# Altium project controller_V1.2.PrjPcb
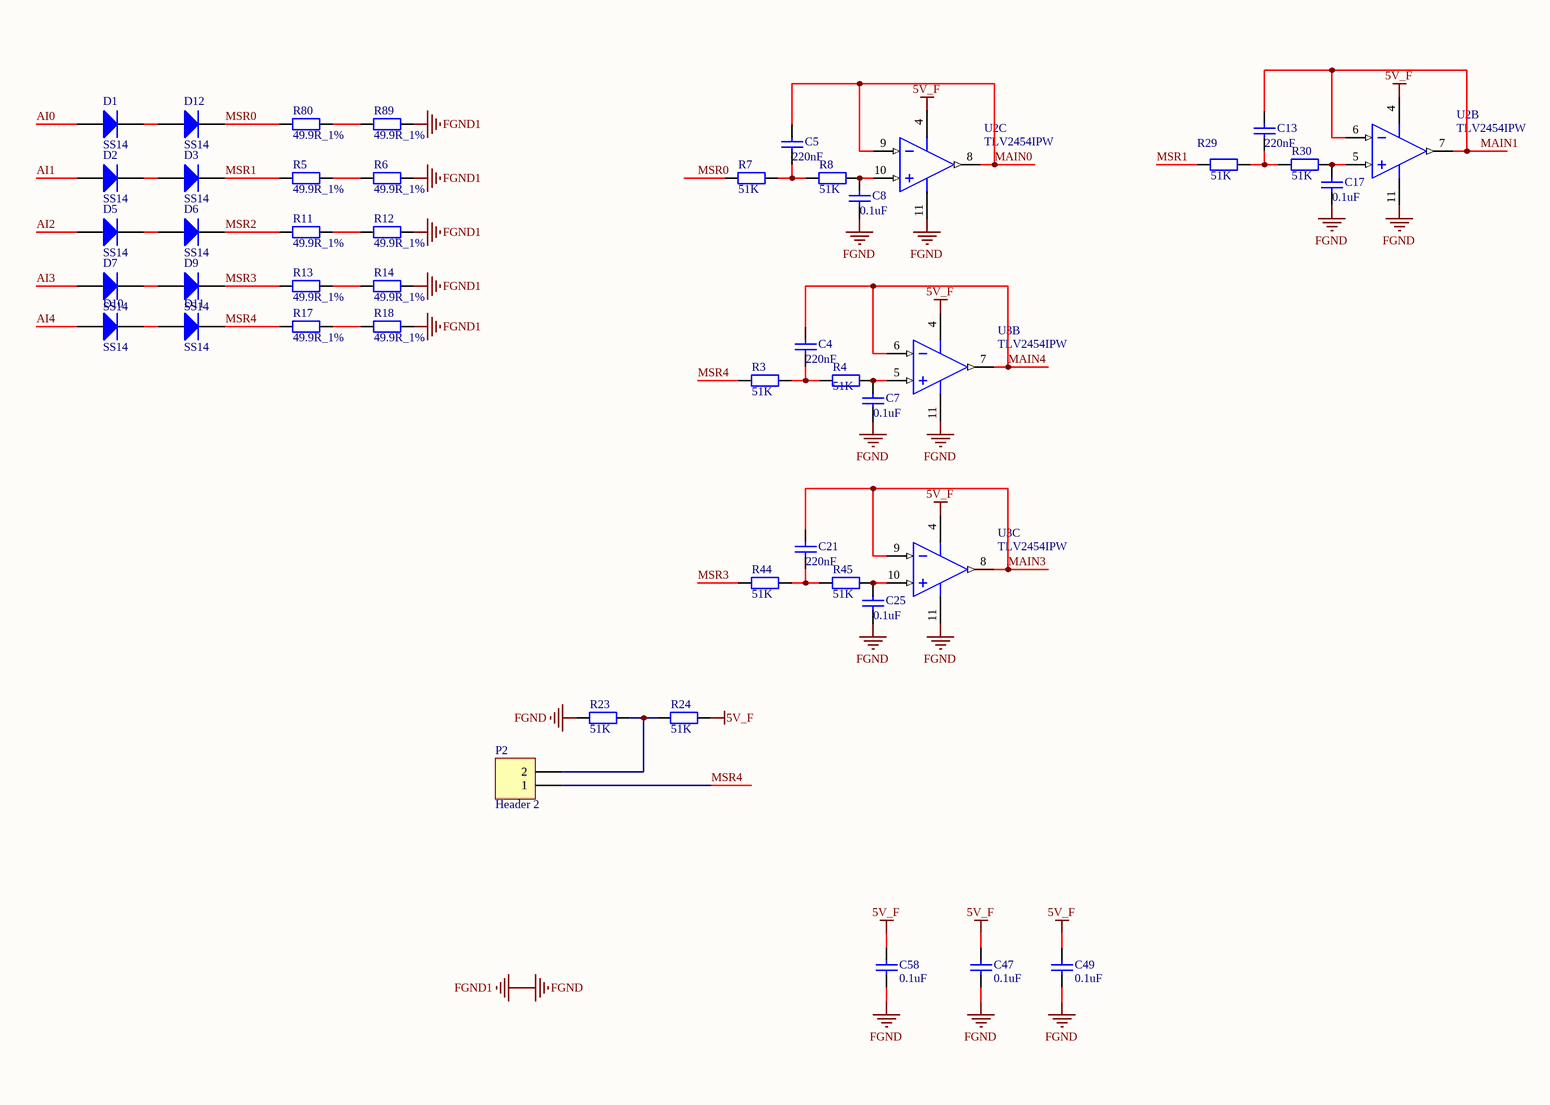
[diagram p0: ai.SchDoc, top left]
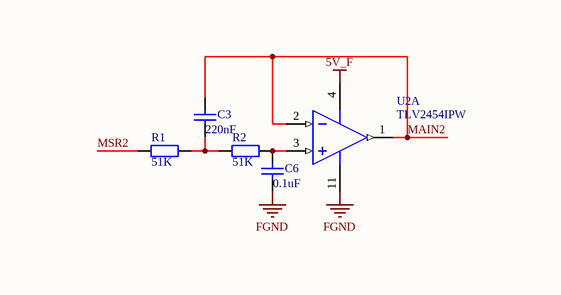
[diagram p1: ai.SchDoc, top right]
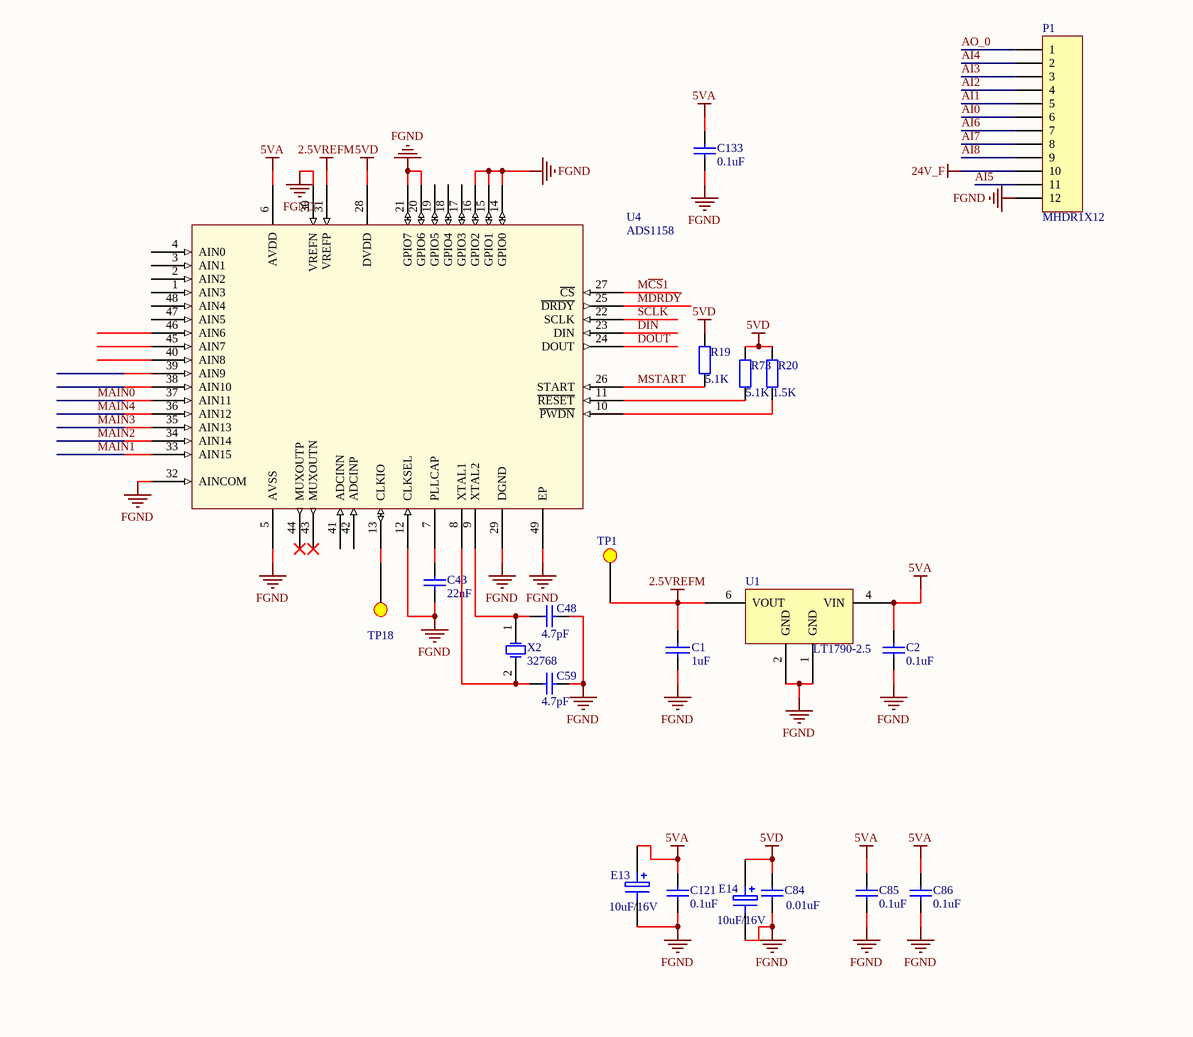
[diagram p2: ai.SchDoc, bottom left]
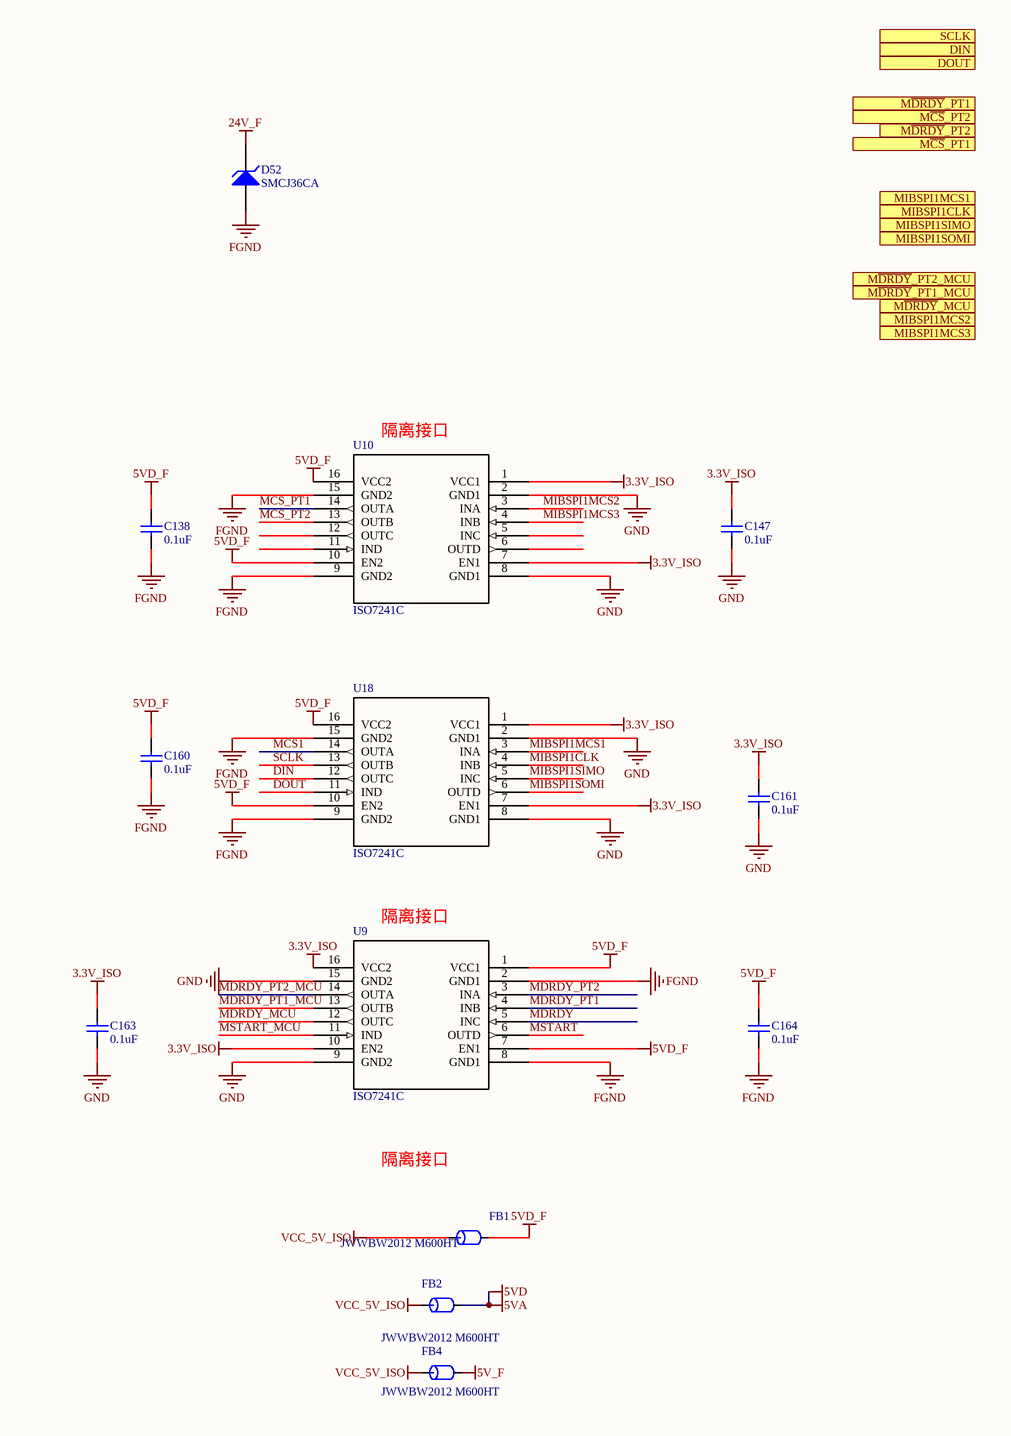
[diagram p3: ai.SchDoc, bottom right]
5 sheets, 223 parts. Net scope: global (net labels, ports and power ports of the same name join across sheets).
Board file: controller_V1.1.PcbDoc
Sheets:
  ai.SchDoc
  di.SchDoc
  mcu.SchDoc
  power1.SchDoc
  relay1.SchDoc

## Sheet ai.SchDoc
size A1

### Parts
C1  1uF  [0603C]
C2  0.1uF  [0603C]
C3  220nF  [0805C]
C4  220nF  [0805C]
C5  220nF  [0805C]
C6  0.1uF  [0603C]
C7  0.1uF  [0603C]
C8  0.1uF  [0603C]
C13  220nF  [0805C]
C17  0.1uF  [0603C]
C21  220nF  [0805C]
C25  0.1uF  [0603C]
C43  22nF  [0805C]
C47  0.1uF  [0603C]
C48  4.7pF  [0603C]
C49  0.1uF  [0603C]
C58  0.1uF  [0603C]
C59  4.7pF  [0603C]
C84  0.01uF  [0603C]
C85  0.1uF  [0603C]
C86  0.1uF  [0603C]
C121  0.1uF  [0603C]
C133  0.1uF  [0603C]
C138  0.1uF  [0603C]
C147  0.1uF  [0603C]
C160  0.1uF  [0603C]
C161  0.1uF  [0603C]
C163  0.1uF  [0603C]
C164  0.1uF  [0603C]
D1  SS14  [DO-214AC]
D2  SS14  [DO-214AC]
D3  SS14  [DO-214AC]
D5  SS14  [DO-214AC]
D6  SS14  [DO-214AC]
D7  SS14  [DO-214AC]
D9  SS14  [DO-214AC]
D10  SS14  [DO-214AC]
D11  SS14  [DO-214AC]
D12  SS14  [DO-214AC]
D52  SMCJ36CA  [SMC]
E13  10uF/16V  [C3528]
E14  10uF/16V  [C3528]
FB1  JWWBW2012 M600HT  [0805R]
FB2  JWWBW2012 M600HT  [0805R]
FB4  JWWBW2012 M600HT  [0805R]
P1  MHDR1X12  [2ETYR-5.08-12P-14-100]
P2  Header 2  [HDR1X2]  (no BOM)
R1  51K  [0603R]
R2  51K  [0603R]
R3  51K  [0603R]
R4  51K  [0603R]
R5  49.9R_1%  [0805R]
R6  49.9R_1%  [0805R]
R7  51K  [0603R]
R8  51K  [0603R]
R11  49.9R_1%  [0805R]
R12  49.9R_1%  [0805R]
R13  49.9R_1%  [0805R]
R14  49.9R_1%  [0805R]
R17  49.9R_1%  [0805R]
R18  49.9R_1%  [0805R]
R19  5.1K  [0603R]
R20  1.5K  [0603R]
R23  51K  [0603R]
R24  51K  [0603R]
R29  51K  [0603R]
R30  51K  [0603R]
R44  51K  [0603R]
R45  51K  [0603R]
R73  5.1K  [0603R]
R80  49.9R_1%  [0805R]
R89  49.9R_1%  [0805R]
TP1  TEST_POINT  [TPD]  (value not drawn)
TP18  TEST_POINT  [TPD]  (value not drawn)
U1  LT1790-2.5  [SOT23-6]
U2  TLV2454IPW  [TSSOP14]  (parts A,B,C of 4)
U3  TLV2454IPW  [TSSOP14]  (parts B,C of 4)
U4  ADS1158  [S-PVFQN-N48]
U9  ISO7241C  [SOIC16]
U10  ISO7241C  [SOIC16]
U18  ISO7241C  [SOIC16]
X2  32768  [A]

### Ports
DIN (in), DOUT (out), MIBSPI1CLK (in), MIBSPI1MCS1 (in), MIBSPI1MCS2 (in), MIBSPI1MCS3 (in), MIBSPI1SIMO (in), MIBSPI1SOMI (out), M~{CS}_PT1 (out), M~{CS}_PT2 (out), M~{DRDY}_MCU (out), M~{DRDY}_PT1 (out), M~{DRDY}_PT1_MCU (out), M~{DRDY}_PT2 (out), M~{DRDY}_PT2_MCU (out), SCLK (in)

### Nets
2.5VREFM: C1.1 TP1.1 U1.6(VOUT) U4.31(VREFP)
3.3V_ISO: C147.2 C161.2 C163.2 U9.10(EN2) U9.16(VCC2) U10.1(VCC1) U10.7(EN1) U18.1(VCC1) U18.7(EN1)
5V_F: C47.2 C49.2 C58.2 FB4.2 R24.2 U2.4(V+) U3.4(V+)
5VA: C2.2 C84.2 C85.2 C86.2 C121.2 C133.2 E13.1 E14.1 FB2.2 R19.1 R20.1 R73.1 U1.4(VIN) U4.6(AVDD) U4.28(DVDD)  [also labelled 5VD]
5VD_F: C138.2 C160.2 C164.2 FB1.2 U9.1(VCC1) U9.7(EN1) U10.10(EN2) U10.16(VCC2) U18.10(EN2) U18.16(VCC2)
24V_F: D52.2(K) P1.10
FGND: C1.2 C2.1 C6.1 C7.1 C8.1 C17.1 C25.1 C43.2 C47.1 C48.2 C49.1 C58.1 C59.2 C84.1 C85.1 C86.1 C121.1 C133.1 C138.1 C160.1 C164.1 D52.1(A) E13.2 E14.2 P1.12 R6.1 R12.1 R14.1 R18.1 R23.1 R89.1 U1.1(GND) U1.2(GND) U2.11(GND) U3.11(GND) U4.5(AVSS) U4.12(CLKSEL) U4.14(GPIO0) U4.15(GPIO1) U4.16(GPIO2) U4.20(GPIO6) U4.21(GPIO7) U4.29(DGND) U4.30(VREFN) U4.32(AINCOM) U4.49(EP) U9.2(GND1) U9.8(GND1) U10.9(GND2) U10.15(GND2) U18.9(GND2) U18.15(GND2)  [also labelled FGND1]
GND: C147.1 C161.1 C163.1 U9.9(GND2) U9.15(GND2) U10.2(GND1) U10.8(GND1) U18.2(GND1) U18.8(GND1)
VCC_5V_ISO: FB1.1 FB2.1 FB4.1
AI0: D1.1(A) P1.6
AI1: D2.1(A) P1.5
AI2: D5.1(A) P1.4
AI3: D7.1(A) P1.3
AI4: D10.1(A) P1.2
AI5: P1.11
AI6: P1.7
AI7: P1.8
AI8: P1.9
AO_0: P1.1
DIN: U4.23(DIN) U18.12(OUTC)
DOUT: U4.24(DOUT) U18.11(IND)
MAIN0: C5.2 U2.8(OUT) U2.9(IN-) U4.37(AIN11)
MAIN1: C13.2 U2.6(IN-) U2.7(OUT) U4.33(AIN15)
MAIN2: C3.2 U2.1(OUT) U2.2(IN-) U4.34(AIN14)
MAIN3: C21.2 U3.8(OUT) U3.9(IN-) U4.35(AIN13)
MAIN4: C4.2 U3.6(IN-) U3.7(OUT) U4.36(AIN12)
M~{CS}1: U4.27(~{CS}) U18.14(OUTA)
M~{CS}_PT1: U10.14(OUTA)
M~{CS}_PT2: U10.13(OUTB)
M~{DRDY}: U4.25(~{DRDY}) U9.5(INC)
M~{DRDY}_MCU: U9.12(OUTC)
M~{DRDY}_PT1: U9.4(INB)
M~{DRDY}_PT1_MCU: U9.13(OUTB)
M~{DRDY}_PT2: U9.3(INA)
M~{DRDY}_PT2_MCU: U9.14(OUTA)
MIBSPI1CLK: U18.4(INB)
MIBSPI1MCS1: U18.3(INA)
MIBSPI1MCS2: U10.3(INA)
MIBSPI1MCS3: U10.4(INB)
MIBSPI1SIMO: U18.5(INC)
MIBSPI1SOMI: U18.6(OUTD)
MSR0: D12.2(K) R7.2 R80.2
MSR1: D3.2(K) R5.2 R29.2
MSR2: D6.2(K) R1.2 R11.2
MSR3: D9.2(K) R13.2 R44.2
MSR4: D11.2(K) P2.1 R3.2 R17.2
MSTART: R19.2 U4.26(START) U9.6(OUTD)
MSTART_MCU: U9.11(IND)
SCLK: U4.22(SCLK) U18.13(OUTB)
NetC3_1: C3.1 R1.1 R2.2
NetC4_1: C4.1 R3.1 R4.2
NetC5_1: C5.1 R7.1 R8.2
NetC6_2: C6.2 R2.1 U2.3(IN+)
NetC7_2: C7.2 R4.1 U3.5(IN+)
NetC8_2: C8.2 R8.1 U2.10(IN+)
NetC13_1: C13.1 R29.1 R30.2
NetC17_2: C17.2 R30.1 U2.5(IN+)
NetC21_1: C21.1 R44.1 R45.2
NetC25_2: C25.2 R45.1 U3.10(IN+)
NetC43_1: C43.1 U4.7(PLLCAP)
NetC48_1: C48.1 U4.9(XTAL2) X2.1(OSC1)
NetC59_1: C59.1 U4.8(XTAL1) X2.2(OSC2)
NetD1_2: D1.2(K) D12.1(A)
NetD2_2: D2.2(K) D3.1(A)
NetD5_2: D5.2(K) D6.1(A)
NetD7_2: D7.2(K) D9.1(A)
NetD10_2: D10.2(K) D11.1(A)
NetP2_2: P2.2 R23.2 R24.1
NetR5_1: R5.1 R6.2
NetR11_1: R11.1 R12.2
NetR13_1: R13.1 R14.2
NetR17_1: R17.1 R18.2
NetR20_2: R20.2 U4.10(~{PWDN})
NetR73_2: R73.2 U4.11(~{RESET})
NetR80_1: R80.1 R89.2
NetTP18_1: TP18.1 U4.13(CLKIO)

Not connected (* = marked no-connect by the designer): U1 3(DNC) 5(DNC); U4 1(AIN3) 2(AIN2) 3(AIN1) 4(AIN0) 17(GPIO3) 18(GPIO4) 19(GPIO5) 38(AIN10) 39(AIN9) 40(AIN8) 41(ADCINN) 42(ADCINP) 43(MUXOUTN)* 44(MUXOUTP)* 45(AIN7) 46(AIN6) 47(AIN5) 48(AIN4); U10 5(INC) 6(OUTD) 11(IND) 12(OUTC)

### Notes on the sheet
- (near U10) 隔离接口
- (near U9) 隔离接口
- 隔离接口

### Library data of the parts
C1 = CAP: Capacitor
C2-C8 C13 C17 C21 C25 C43 C47-C49 C58 C84-C86 C121 C133 C138 C147 C160 C161 C163 C164 = Cap: Capacitor; Published: 8-Jun-2000; LatestRevisionDate: 17-Jul-2002; LatestRevisionNote: Re-released for DXP Platform.; PackageReference: RAD-0.3; Publisher: Altium Limited; PackageDescription: Radial Cap, Thru-Hole; 2 Leads; 0.3 in Pin Spacing
  C2 C47 C49 C58 C85 C86 C121 C133 C138 C147 C160 C161 C163 C164: Value: 0.1uF
C59 = Cap: Capacitor; Value: 6.8pF; Published: 8-Jun-2000; LatestRevisionDate: 17-Jul-2002; LatestRevisionNote: Re-released for DXP Platform.; PackageReference: RAD-0.3; Publisher: Altium Limited; PackageDescription: Radial Cap, Thru-Hole; 2 Leads; 0.3 in Pin Spacing
D1-D3 D5-D7 D9-D12 = Diode: Default Diode; Published: 8-Jun-2000; LatestRevisionDate: 17-Jul-2002; LatestRevisionNote: Re-released for DXP Platform.; PackageVersion: Sep-1996; PackageReference: SMC; Publisher: Altium Limited; Code_JEDEC: DO-214-AB
D52 = D Zener: SMBJ36CA; Published: 8-Jun-2000; LatestRevisionDate: 17-Jul-2002; LatestRevisionNote: Re-released for DXP Platform.; PackageReference: DIODE-0.7; Publisher: Altium Limited
E13 E14 = ELECTRO1: Electrolytic Capacitor
FB1 FB2 FB4 = FB: Part Field 1: 磁珠/0603/1K ohm/100MHz; FB: BLM18BD102SN1(muRata); Text Field1: FB
P1 = MHDR1X12: Header, 12-Pin; LatestRevisionDate: 17-Jul-2002; LatestRevisionNote: Re-released for DXP Platform.; Publisher: Altium Limited
P2 = Header 2: Header, 2-Pin; LatestRevisionDate: 17-Jul-2002; LatestRevisionNote: Re-released for DXP Platform.; Publisher: Altium Limited
R1-R8 R11-R14 R17-R20 R23 R24 R29 R30 R44 R45 R73 R80 R89 = Res0805M
U1 = LT1790-2.5: 2.5V Micropower SOT-23  Low Dropout Reference
U2 U3 = MAX908EPD: Quad High-speed, Ultra Low-power, Single-Supply TTL comparator; Published: 16-Jan-2001; LatestRevisionDate: 29-May-2009; LatestRevisionNote: Component Body Added.; DatasheetVersion: Jul-1994; PackageVersion: RevB, 21-0043; PackageReference: PD14; Publisher: Altium Limited; PackageDescription: DIP, 14-Pin, Row Spacing 7.62 mm, Pitch 2.54 mm; Code_JEDEC: MS-001-AC; ComponentLink1Description: Manufacturer Link; ComponentLink1URL: http://www.maxim-ic.com/; ComponentLink2Description: Datasheet; ComponentLink2URL: http://pdfserv.maxim-ic.com/en/ds/MAX907-MAX909.pdf
U4 = ADS1158: 16-Channel, 16-Bit Analog-to-Digital Converter
X2 = XTAL: Crystal Oscillator; Published: 8-Jun-2000; LatestRevisionDate: 17-Jul-2002; LatestRevisionNote: Re-released for DXP Platform.; PackageReference: R38; Publisher: Altium Limited

## Sheet di.SchDoc
size A2
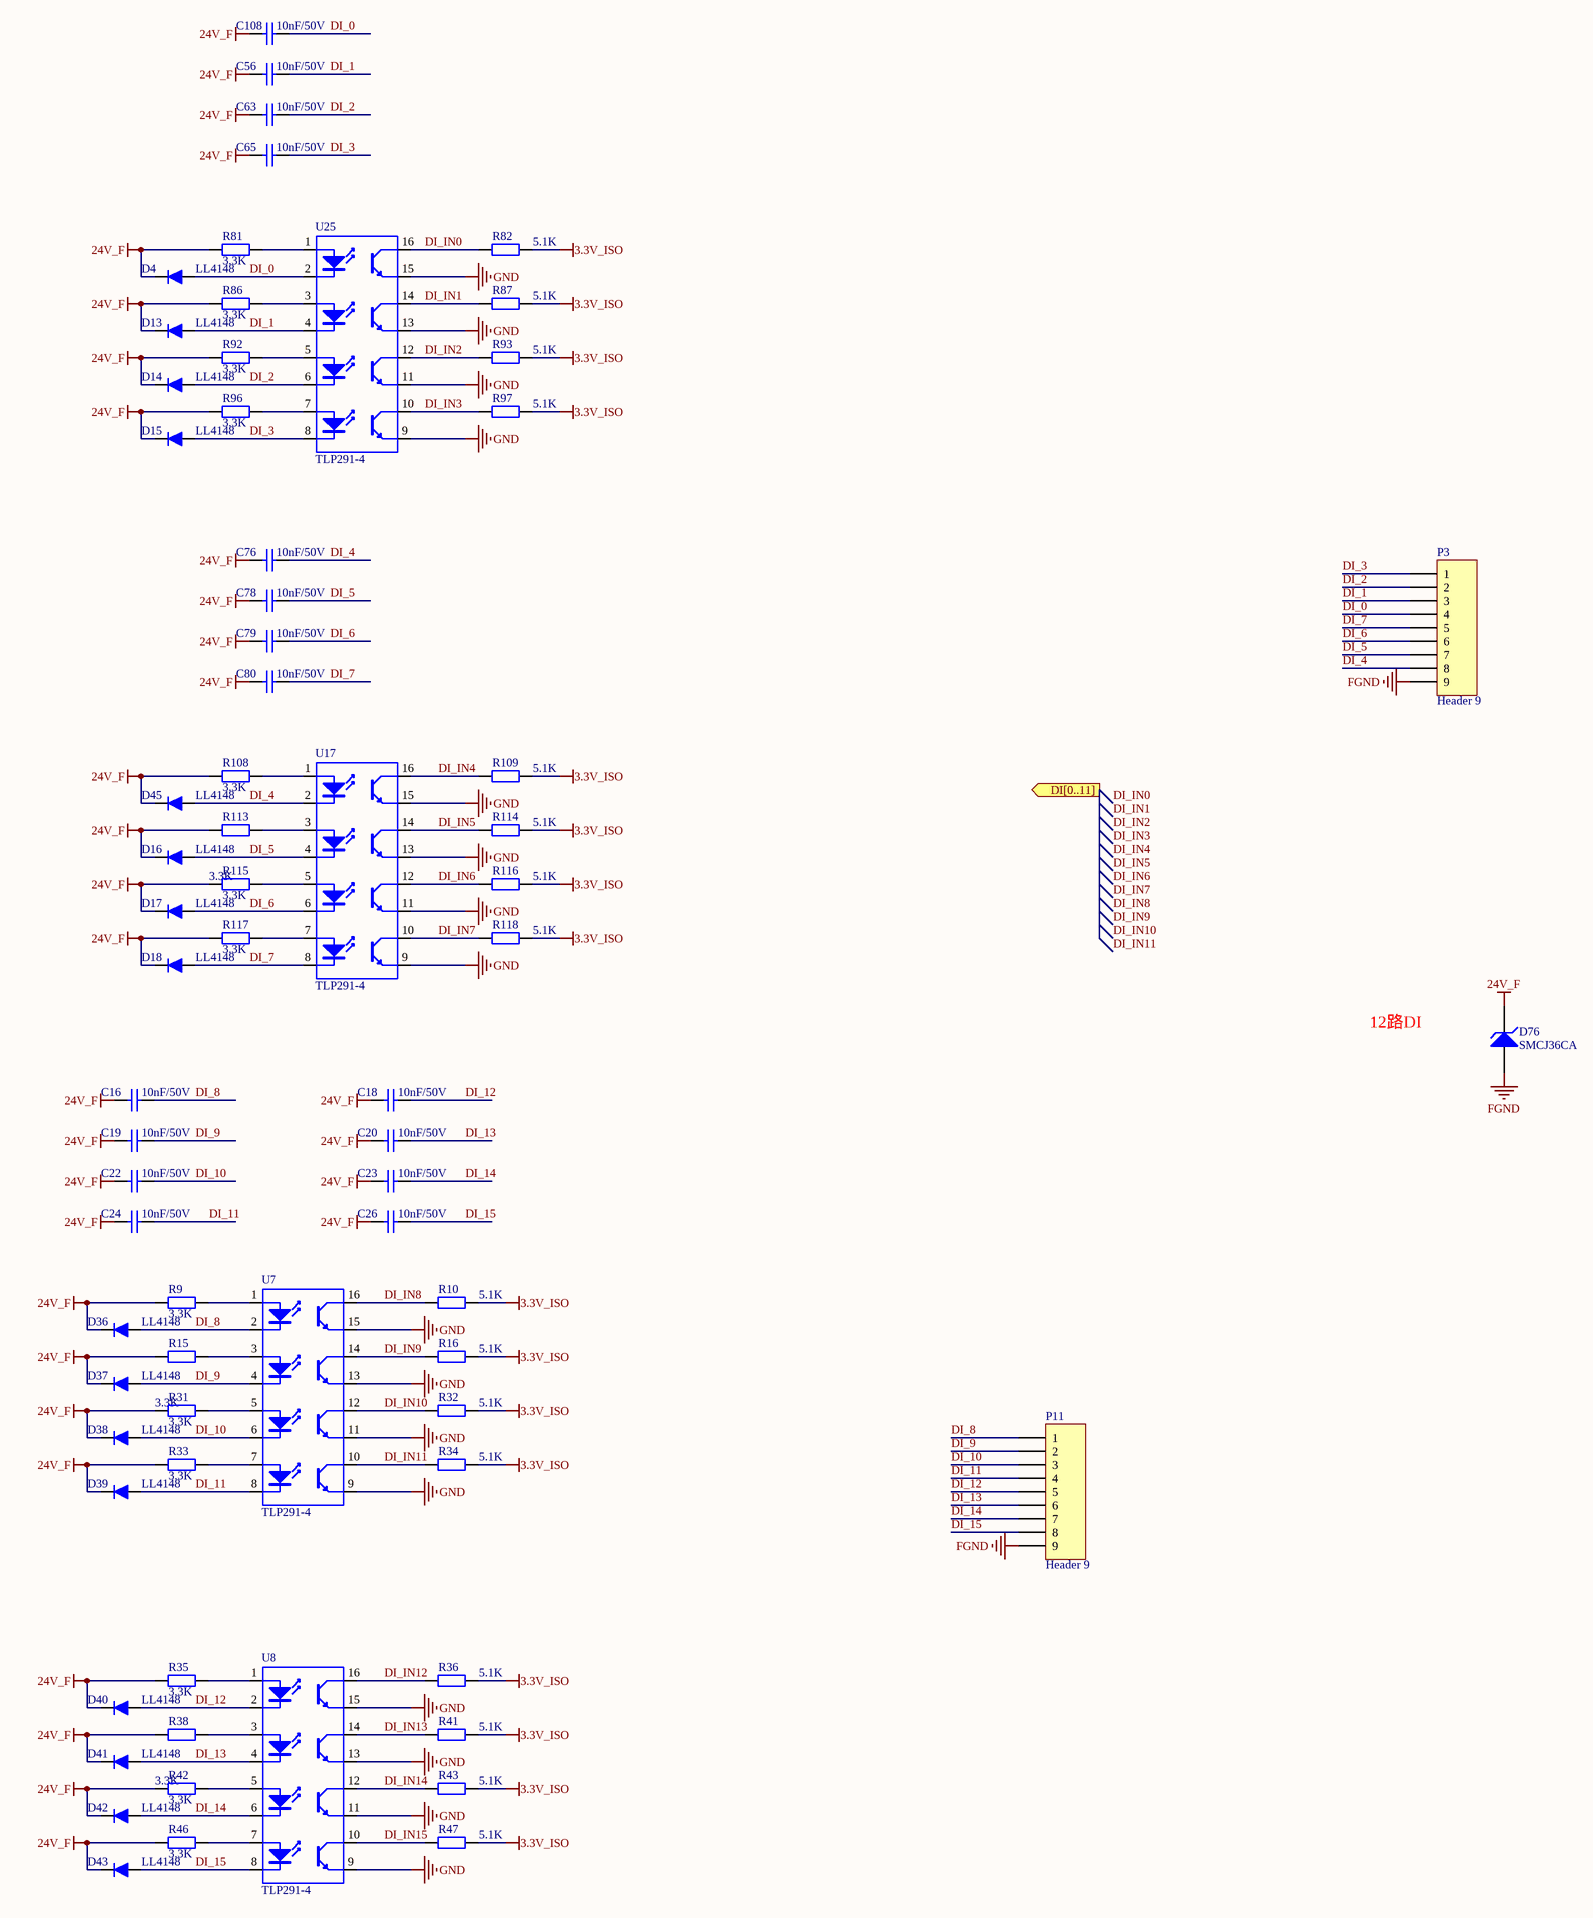
[diagram p4: di.SchDoc]

### Parts
C16  10nF/50V  [0603C]
C18  10nF/50V  [0603C]
C19  10nF/50V  [0603C]
C20  10nF/50V  [0603C]
C22  10nF/50V  [0603C]
C23  10nF/50V  [0603C]
C24  10nF/50V  [0603C]
C26  10nF/50V  [0603C]
C56  10nF/50V  [0603C]
C63  10nF/50V  [0603C]
C65  10nF/50V  [0603C]
C76  10nF/50V  [0603C]
C78  10nF/50V  [0603C]
C79  10nF/50V  [0603C]
C80  10nF/50V  [0603C]
C108  10nF/50V  [0603C]
D4  LL4148  [DO-213AB/LL34/MiniMELF]
D13  LL4148  [DO-213AB/LL34/MiniMELF]
D14  LL4148  [DO-213AB/LL34/MiniMELF]
D15  LL4148  [DO-213AB/LL34/MiniMELF]
D16  LL4148  [DO-213AB/LL34/MiniMELF]
D17  LL4148  [DO-213AB/LL34/MiniMELF]
D18  LL4148  [DO-213AB/LL34/MiniMELF]
D36  LL4148  [DO-213AB/LL34/MiniMELF]
D37  LL4148  [DO-213AB/LL34/MiniMELF]
D38  LL4148  [DO-213AB/LL34/MiniMELF]
D39  LL4148  [DO-213AB/LL34/MiniMELF]
D40  LL4148  [DO-213AB/LL34/MiniMELF]
D41  LL4148  [DO-213AB/LL34/MiniMELF]
D42  LL4148  [DO-213AB/LL34/MiniMELF]
D43  LL4148  [DO-213AB/LL34/MiniMELF]
D45  LL4148  [DO-213AB/LL34/MiniMELF]
D76  SMCJ36CA  [smc]
P3  Header 9  [2ETYR-5.08-09P-14-100]
P11  Header 9  [2ETYR-5.08-09P-14-100]
R9  3.3K  [0603R]
R10  5.1K  [0603R]
R15  3.3K  [0603R]
R16  5.1K  [0603R]
R31  3.3K  [0603R]
R32  5.1K  [0603R]
R33  3.3K  [0603R]
R34  5.1K  [0603R]
R35  3.3K  [0603R]
R36  5.1K  [0603R]
R38  3.3K  [0603R]
R41  5.1K  [0603R]
R42  3.3K  [0603R]
R43  5.1K  [0603R]
R46  3.3K  [0603R]
R47  5.1K  [0603R]
R81  3.3K  [0603R]
R82  5.1K  [0603R]
R86  3.3K  [0603R]
R87  5.1K  [0603R]
R92  3.3K  [0603R]
R93  5.1K  [0603R]
R96  3.3K  [0603R]
R97  5.1K  [0603R]
R108  3.3K  [0603R]
R109  5.1K  [0603R]
R113  3.3K  [0603R]
R114  5.1K  [0603R]
R115  3.3K  [0603R]
R116  5.1K  [0603R]
R117  3.3K  [0603R]
R118  5.1K  [0603R]
U7  TLP291-4  [SOP16-T]
U8  TLP291-4  [SOP16-T]
U17  TLP291-4  [SOP16-T]
U25  TLP291-4  [SOP16-T]

### Ports
DI[0..11] (out)

### Nets
3.3V_ISO: R10.1 R16.1 R32.1 R34.1 R36.1 R41.1 R43.1 R47.1 R82.1 R87.1 R93.1 R97.1 R109.1 R114.1 R116.1 R118.1
24V_F: C16.1 C18.1 C19.1 C20.1 C22.1 C23.1 C24.1 C26.1 C56.1 C63.1 C65.1 C76.1 C78.1 C79.1 C80.1 C108.1 D4.2 D13.2 D14.2 D15.2 D16.2 D17.2 D18.2 D36.2 D37.2 D38.2 D39.2 D40.2 D41.2 D42.2 D43.2 D45.2 D76.2(K) R9.2 R15.2 R31.2 R33.2 R35.2 R38.2 R42.2 R46.2 R81.2 R86.2 R92.2 R96.2 R108.2 R113.2 R115.2 R117.2
FGND: D76.1(A) P3.9 P11.9
GND: U7.9(E) U7.11(E) U7.13(E) U7.15(E) U8.9(E) U8.11(E) U8.13(E) U8.15(E) U17.9(E) U17.11(E) U17.13(E) U17.15(E) U25.9(E) U25.11(E) U25.13(E) U25.15(E)
DI_0: C108.2 D4.1 P3.4 U25.2(K)
DI_1: C56.2 D13.1 P3.3 U25.4(K)
DI_2: C63.2 D14.1 P3.2 U25.6(K)
DI_3: C65.2 D15.1 P3.1 U25.8(K)
DI_4: C76.2 D45.1 P3.8 U17.2(K)
DI_5: C78.2 D16.1 P3.7 U17.4(K)
DI_6: C79.2 D17.1 P3.6 U17.6(K)
DI_7: C80.2 D18.1 P3.5 U17.8(K)
DI_8: C16.2 D36.1 P11.1 U7.2(K)
DI_9: C19.2 D37.1 P11.2 U7.4(K)
DI_10: C22.2 D38.1 P11.3 U7.6(K)
DI_11: C24.2 D39.1 P11.4 U7.8(K)
DI_12: C18.2 D40.1 P11.5 U8.2(K)
DI_13: C20.2 D41.1 P11.6 U8.4(K)
DI_14: C23.2 D42.1 P11.7 U8.6(K)
DI_15: C26.2 D43.1 P11.8 U8.8(K)
DI_IN0: R82.2 U25.16(C)
DI_IN1: R87.2 U25.14(C)
DI_IN2: R93.2 U25.12(C)
DI_IN3: R97.2 U25.10(C)
DI_IN4: R109.2 U17.16(C)
DI_IN5: R114.2 U17.14(C)
DI_IN6: R116.2 U17.12(C)
DI_IN7: R118.2 U17.10(C)
DI_IN8: R10.2 U7.16(C)
DI_IN9: R16.2 U7.14(C)
DI_IN10: R32.2 U7.12(C)
DI_IN11: R34.2 U7.10(C)
DI_IN12: R36.2 U8.16(C)
DI_IN13: R41.2 U8.14(C)
DI_IN14: R43.2 U8.12(C)
DI_IN15: R47.2 U8.10(C)
NetR9_1: R9.1 U7.1(A)
NetR15_1: R15.1 U7.3(A)
NetR31_1: R31.1 U7.5(A)
NetR33_1: R33.1 U7.7(A)
NetR35_1: R35.1 U8.1(A)
NetR38_1: R38.1 U8.3(A)
NetR42_1: R42.1 U8.5(A)
NetR46_1: R46.1 U8.7(A)
NetR81_1: R81.1 U25.1(A)
NetR86_1: R86.1 U25.3(A)
NetR92_1: R92.1 U25.5(A)
NetR96_1: R96.1 U25.7(A)
NetR108_1: R108.1 U17.1(A)
NetR113_1: R113.1 U17.3(A)
NetR115_1: R115.1 U17.5(A)
NetR117_1: R117.1 U17.7(A)

### Notes on the sheet
- 12路DI
- Labels drawn without touching a wire or pin: DI_IN0, DI_IN1, DI_IN2, DI_IN3, DI_IN4, DI_IN5, DI_IN6, DI_IN7, DI_IN8, DI_IN9, DI_IN10, DI_IN11

### Library data of the parts
C16 C18-C20 C22-C24 C26 C56 C63 C65 C76 C78-C80 C108 = Cap: Capacitor; Value: 22nF; Published: 8-Jun-2000; LatestRevisionDate: 17-Jul-2002; LatestRevisionNote: Re-released for DXP Platform.; PackageReference: RAD-0.3; Publisher: Altium Limited; PackageDescription: Radial Cap, Thru-Hole; 2 Leads; 0.3 in Pin Spacing
D4 D13-D18 D36-D43 D45 = LL4148: VISHAY,LL4148,圆柱体MiniMELF100V/2A,ROHS; 版本: V1.00; 名称: 快速开关二极管; 物料编号: APLLY; 制造商: VISHAY
D76 = D Zener: SMBJ36CA; Published: 8-Jun-2000; LatestRevisionDate: 17-Jul-2002; LatestRevisionNote: Re-released for DXP Platform.; PackageReference: DIODE-0.7; Publisher: Altium Limited
P3 P11 = Header 9: Header, 9-Pin; LatestRevisionDate: 17-Jul-2002; LatestRevisionNote: Re-released for DXP Platform.; Publisher: Altium Limited
R9 R10 R15 R16 R31-R36 R38 R41-R43 R46 R47 R81 R82 R86 R87 R92 R93 R96 R97 R108 R109 R113-R118 = Res0805M
U7 U8 U17 U25 = TLP281-4

## Sheet mcu.SchDoc
size A3
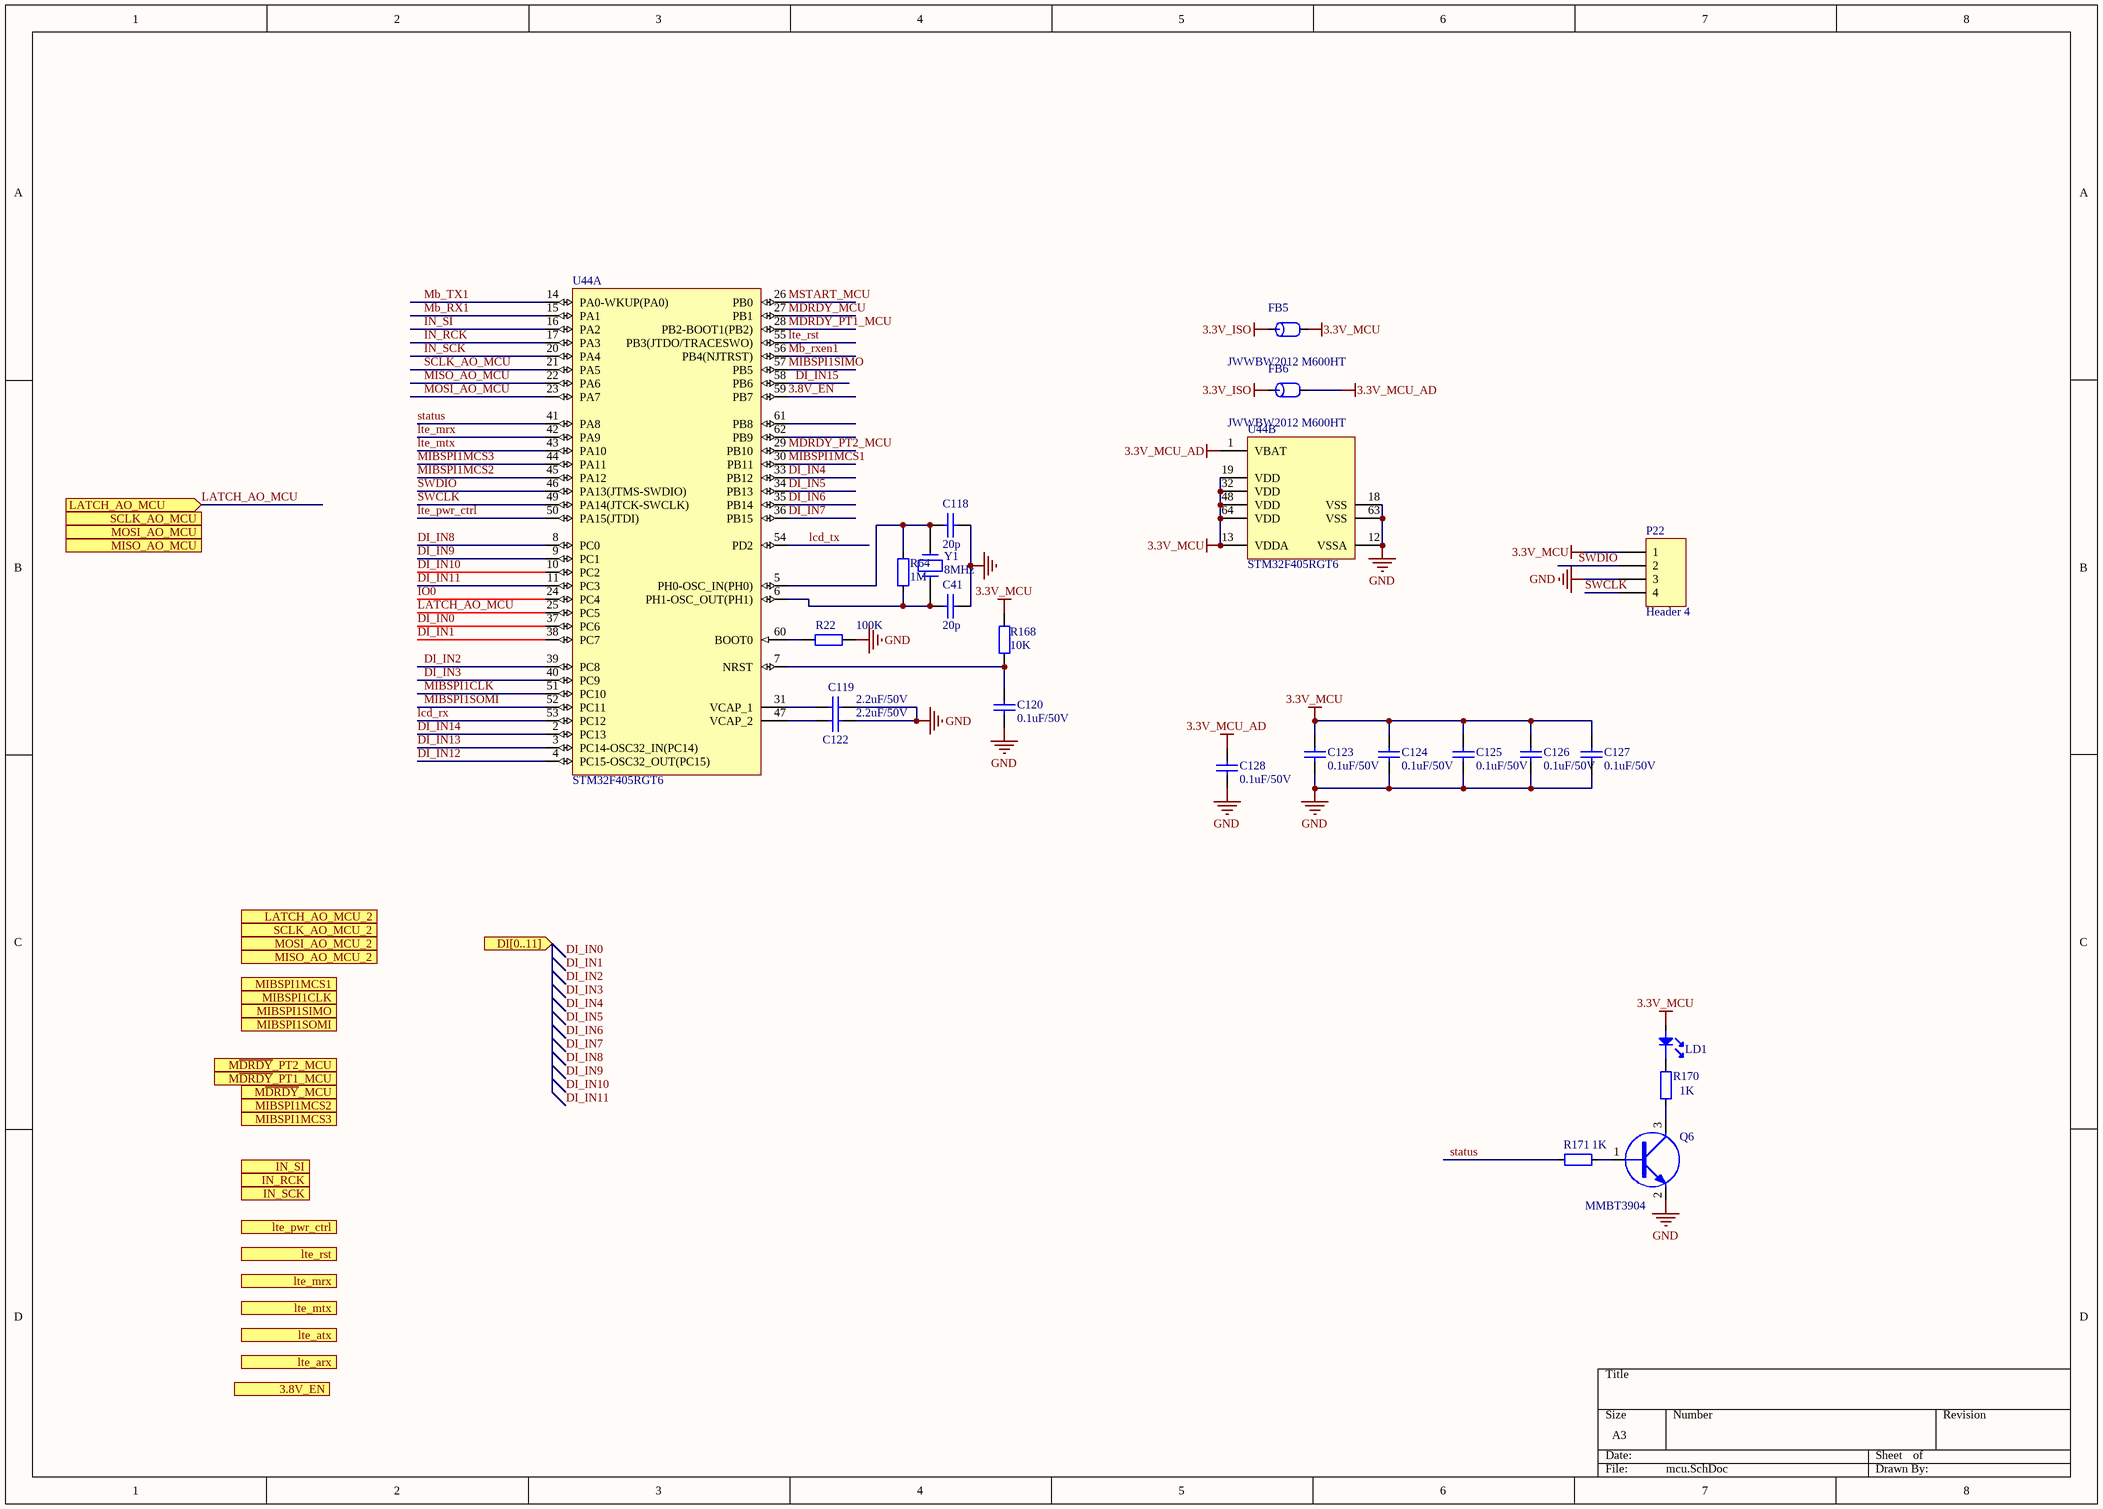
[diagram p5: mcu.SchDoc]

### Parts
C41  20p  [0603c]
C118  20p  [0603c]
C119  2.2uF/50V  [0603C]
C120  0.1uF/50V  [0603C]
C122  2.2uF/50V  [0603C]
C123  0.1uF/50V  [0603C]
C124  0.1uF/50V  [0603C]
C125  0.1uF/50V  [0603C]
C126  0.1uF/50V  [0603C]
C127  0.1uF/50V  [0603C]
C128  0.1uF/50V  [0603C]
FB5  JWWBW2012 M600HT  [0805R]
FB6  JWWBW2012 M600HT  [0805R]
LD1  LED_Green_19-217  [0603led]  (value not drawn)
P22  Header 4  [HDR1X4]
Q6  MMBT3904  [SOT23-3]
R22  100K  [0603R]
R64  1M  [0603R]
R168  10K  [0603R]
R170  1K  [0603r]
R171  1K  [0603r]
U44  STM32F405RGT6  [LQFP-64]  (parts A,B of 2)
Y1  8MHz  [CRAY_5032]

### Ports
3.8V_EN (out), DI[0..11] (in), IN_RCK (out), IN_SCK (out), IN_SI (out), LATCH_AO_MCU (in), LATCH_AO_MCU_2 (out), lte_arx (out), lte_atx (in), lte_mrx (out), lte_mtx (in), lte_pwr_ctrl (out), lte_rst (out), MIBSPI1CLK (in), MIBSPI1MCS1 (in), MIBSPI1MCS2 (in), MIBSPI1MCS3 (in), MIBSPI1SIMO (in), MIBSPI1SOMI (out), MISO_AO_MCU (out), MISO_AO_MCU_2 (in), MOSI_AO_MCU (in), MOSI_AO_MCU_2 (out), M~{DRDY}_MCU (out), M~{DRDY}_PT1_MCU (in), M~{DRDY}_PT2_MCU (in), SCLK_AO_MCU (in), SCLK_AO_MCU_2 (out)

### Nets
3.3V_ISO: FB5.1 FB6.1
3.3V_MCU: C123.2 C124.2 C125.2 C126.2 C127.2 FB5.2 LD1.1 P22.1 R168.2 U44.13(VDDA) U44.19(VDD) U44.32(VDD) U44.48(VDD) U44.64(VDD)
3.3V_MCU_AD: C128.2 FB6.2 U44.1(VBAT)
GND: C41.1 C118.1 C119.1 C120.1 C122.1 C123.1 C124.1 C125.1 C126.1 C127.1 C128.1 P22.3 Q6.2(E) R22.2 U44.12(VSSA) U44.18(VSS) U44.63(VSS)
3.8V_EN: U44.59(PB7)
DI_IN0: U44.37(PC6)
DI_IN1: U44.38(PC7)
DI_IN2: U44.39(PC8)
DI_IN3: U44.40(PC9)
DI_IN4: U44.33(PB12)
DI_IN5: U44.34(PB13)
DI_IN6: U44.35(PB14)
DI_IN7: U44.36(PB15)
DI_IN8: U44.8(PC0)
DI_IN9: U44.9(PC1)
DI_IN10: U44.10(PC2)
DI_IN11: U44.11(PC3)
DI_IN12: U44.4(PC15-OSC32_OUT(PC15))
DI_IN13: U44.3(PC14-OSC32_IN(PC14))
DI_IN14: U44.2(PC13)
DI_IN15: U44.58(PB6)
IN_RCK: U44.17(PA3)
IN_SCK: U44.20(PA4)
IN_SI: U44.16(PA2)
IO0: U44.24(PC4)
LATCH_AO_MCU: U44.25(PC5) ; port LATCH_AO_MCU
lcd_rx: U44.53(PC12)
lcd_tx: U44.54(PD2)
lte_mrx: U44.42(PA9)
lte_mtx: U44.43(PA10)
lte_pwr_ctrl: U44.50(PA15(JTDI))
lte_rst: U44.55(PB3(JTDO/TRACESWO))
Mb_RX1: U44.15(PA1)
Mb_rxen1: U44.56(PB4(NJTRST))
Mb_TX1: U44.14(PA0-WKUP(PA0))
M~{DRDY}_MCU: U44.27(PB1)
M~{DRDY}_PT1_MCU: U44.28(PB2-BOOT1(PB2))
M~{DRDY}_PT2_MCU: U44.29(PB10)
MIBSPI1CLK: U44.51(PC10)
MIBSPI1MCS1: U44.30(PB11)
MIBSPI1MCS2: U44.45(PA12)
MIBSPI1MCS3: U44.44(PA11)
MIBSPI1SIMO: U44.57(PB5)
MIBSPI1SOMI: U44.52(PC11)
MISO_AO_MCU: U44.22(PA6)
MOSI_AO_MCU: U44.23(PA7)
MSTART_MCU: U44.26(PB0)
SCLK_AO_MCU: U44.21(PA5)
status: R171.1 U44.41(PA8)
SWCLK: P22.4 U44.49(PA14(JTCK-SWCLK))
SWDIO: P22.2 U44.46(PA13(JTMS-SWDIO))
NetC41_2: C41.2 R64.1 U44.6(PH1-OSC_OUT(PH1)) Y1.2
NetC118_2: C118.2 R64.2 U44.5(PH0-OSC_IN(PH0)) Y1.1
NetC119_2: C119.2 U44.31(VCAP_1)
NetC120_2: C120.2 R168.1 U44.7(NRST)
NetC122_2: C122.2 U44.47(VCAP_2)
NetLD1_2: LD1.2 R170.1
NetQ6_1: Q6.1(B) R171.2
NetQ6_3: Q6.3(C) R170.2
NetR22_1: R22.1 U44.60(BOOT0)

Not connected (* = marked no-connect by the designer): U44 61(PB8) 62(PB9)

### Notes on the sheet
- Labels drawn without touching a wire or pin: DI_IN0, DI_IN1, DI_IN2, DI_IN3, DI_IN4, DI_IN5, DI_IN6, DI_IN7, DI_IN8, DI_IN9, DI_IN10, DI_IN11

### Library data of the parts
C41 C118 = CAP: Capacitor
C119 C120 C122-C128 = Cap: Capacitor; Value: 22nF; Published: 8-Jun-2000; LatestRevisionDate: 17-Jul-2002; LatestRevisionNote: Re-released for DXP Platform.; PackageReference: RAD-0.3; Publisher: Altium Limited; PackageDescription: Radial Cap, Thru-Hole; 2 Leads; 0.3 in Pin Spacing
FB5 FB6 = FB: as FB1 on sheet ai; Text Field1: FB
LD1 = LED_Green_19-217: 物料主编码(PN): 100000032; Value: 19-217/G7C-AN1P2/3T; ID: 6; 序号: 33; 物料名称: 绿色LED; 物料描述: Other,LED,绿色,0603,1.6X0.8X0.4mm,19-217/G7C-AN1P2/3T; 工作温度: –40°C to 85°C; 制造商: Everlight; 器件等级: ——; 物料类型: 特殊二极管; 规格型号(完整型号): 19-217/G7C-AN1P2/3T
P22 = Header 4: Header, 4-Pin; LatestRevisionDate: 17-Jul-2002; LatestRevisionNote: Re-released for DXP Platform.; Publisher: Altium Limited
Q6 = NPN_MMBT3904
R22 R168 = Res0805M
R64 R170 R171 = RES0603: 物料主编码(PN): 150000040; ID: 233; 序号: 109; 物料名称: 贴片电阻; 精度: ±1%; 规格型号(完整型号): RC1608F103CS/RC0603FR-0710KL; 物料描述: RES,贴片电阻,0603,10k,±1%,1/10W,1.6X0.8X0.45mm,RC1608F103CS/RC0603FR-0710KL; 工作温度: –55°C to 155°C; 制造商: 三星/YAGEO; 器件等级: ——; 物料类型: 表贴电阻; 参数值: 1.00E+04
  R64: Value: 1M
  R170 R171: Value: 1K
U44 = STM32F405RGT6: ARM Cortex-M4 32-bit MCU+FPU, 210 DMIPS, 1024 kB Flash, 192 kB Internal RAM, 51 I/Os, 64-pin LQFP, -40 to 85 degC, Tray; Manufacturer: STMicroelectronics; D/A Converter: 2x12-bit; FLASH Size (Prog) (kB): 1024; I/Os (High Current): 51; Internal RAM Size (kB): 192; Operating Frequency(F) (Processor speed) (MHz): 168; Supply Voltage(Vcc) max (V): 3.6; Supply Voltage(Vcc) min (V): 1.8; DatasheetVersion: Rev. 4; PackageVersion: Rev. 4, 06/2013; PackageReference: LQFP64; PackageDescription: 64-Pin Low Profile Quad Flat Package, 10 x 10 mm Body, 0.5 mm Pitch; Supplier 1: Digi-Key; Supplier Part Number 1: 497-11767-ND; Supplier 2: Farnell; Supplier Part Number 2: 2064363; Supplier 3: Newark; Supplier Part Number 3: 73T2329; Supplier 4: Mouser; Supplier Part Number 4: 511-STM32F405RGT6; Core: ARM Cortex-M4; Packing: Tray; Mounting Technology: Surface Mount; PartNumber: STM32F405RGT6; ComponentLink1Description: Manufacturer URL; ComponentLink1URL: http://www.st.com/web/en/home.html; ComponentLink2Description: Datasheet; ComponentLink2URL: http://www.st.com/st-web-ui/static/active/en/resource/technical/document/datasheet/DM00037051.pdf; ComponentLink3Description: Package Specification; ComponentLink3URL: http://www.st.com/st-web-ui/static/active/en/resource/technical/document/datasheet/DM00037051.pdf
Y1 = CRYSTAL: HC49S-8MHz

## Sheet power1.SchDoc
size A2
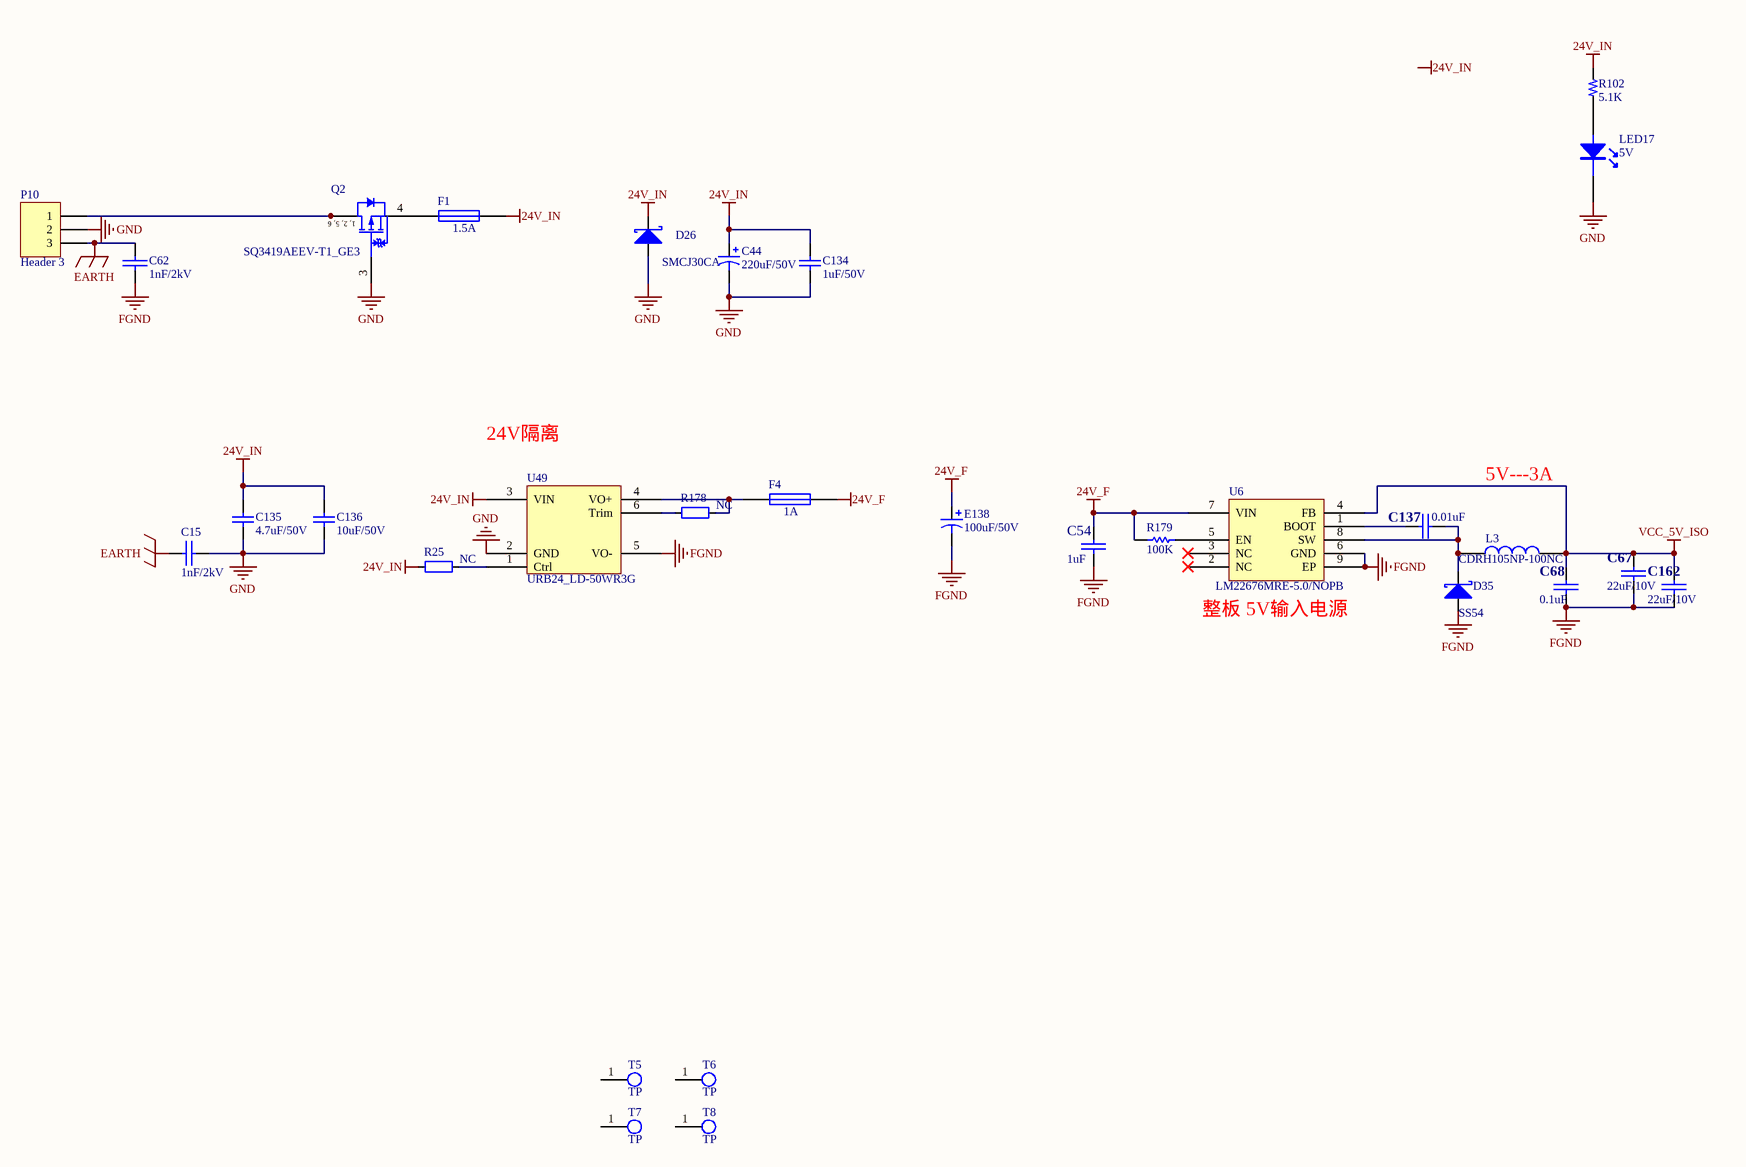
[diagram p6: power1.SchDoc]

### Parts
C15  1nF/2kV  [1206C]
C44  220uF/50V  [Φ10×10]
C54  1uF  [0603C]
C62  1nF/2kV  [1206C]
C67  22uF/10V  [1210C]
C68  0.1uF  [0603C]
C134  1uF/50V  [1210C]
C135  4.7uF/50V  [1210C]
C136  10uF/50V  [1210C]
C137  0.01uF  [0603C]
C162  22uF/10V  [1210C]
D26  SMCJ30CA  [SMC]
D35  SS54  [SMC]
E138  100uF/50V  [Φ10×10]
F1  1.5A  [1812-F]
F4  1A  [1812-F]
L3  CDRH105NP-100NC  [CDRH105]
LED17  5V  [0603LED]
P10  Header 3  [2ETYR-5.08-03P-14-100]
Q2  SQ3419AEEV-T1_GE3  [VISH-TSOP-6_V]
R25  NC  [0603r]  (no BOM)
R102  5.1K  [0603R]
R178  NC  [0603r]  (no BOM)
R179  100K  [0603R]
T5  TP  [m2.5]
T6  TP  [m2.5]
T7  TP  [m2.5]
T8  TP  [m2.5]
U6  LM22676MRE-5.0/NOPB  [SOP127P600X168_HS-8N]
U49  URB24_LD-50WR3G  [URB24_LD-50WR3G]

### Nets
24V_F: C54.2 E138.1 F4.2 R179.2 U6.7(VIN)
24V_IN: C44.1 C134.2 C135.2 C136.2 D26.2(K) F1.2 R25.1 R102.2 U49.3(VIN)
EARTH: C15.2 C62.2 P10.3
FGND: C54.1 C62.1 C67.2 C68.2 C162.2 D35.1(A) E138.2 U6.6(GND) U6.9(EP) U49.5(VO-)
GND: C15.1 C44.2 C134.1 C135.1 C136.1 D26.1(A) LED17.2 P10.2 Q2.3(G) U49.2(GND)
VCC_5V_ISO: C67.1 C68.1 C162.1 L3.2 U6.4(FB)
NetC137_1: C137.1 D35.2(K) L3.1 U6.8(SW)
NetC137_2: C137.2 U6.1(BOOT)
NetF1_1: F1.1 Q2.4(S)
NetF4_1: F4.1 R178.2 U49.4(VO+)
NetLED17_1: LED17.1 R102.1
NetP10_1: P10.1 Q2.1(D) Q2.2(D) Q2.5(D) Q2.6(D)
NetR25_2: R25.2 U49.1(Ctrl)
NetR178_1: R178.1 U49.6(Trim)
NetR179_1: R179.1 U6.5(EN)

Not connected (* = marked no-connect by the designer): T5 1; T6 1; T7 1; T8 1; U6 2(NC)* 3(NC)*

### Notes on the sheet
- 24V隔离
- 5V---3A
- (near U6) 整板 5V输入电源
- Labels drawn without touching a wire or pin: 24V_IN
- (in symbol SQ3419AEEV-T1_GE3) 1, 2, 5, 6

### Library data of the parts
C15 C54 C62 C67 C68 C137 C162 = CAP: Capacitor
C44 = Cap Pol1: Polarized Capacitor (Radial); Published: 8-Jun-2000; LatestRevisionDate: 17-Jul-2002; LatestRevisionNote: Re-released for DXP Platform.; PackageReference: RB7.6-15; Publisher: Altium Limited; Value: 220uF/50V
C134-C136 = Cap: Capacitor; Value: 22nF; Published: 8-Jun-2000; LatestRevisionDate: 17-Jul-2002; LatestRevisionNote: Re-released for DXP Platform.; PackageReference: RAD-0.3; Publisher: Altium Limited; PackageDescription: Radial Cap, Thru-Hole; 2 Leads; 0.3 in Pin Spacing
D26 D35 = DIODE S: Schottky Diode
E138 = Cap Pol1: Polarized Capacitor (Radial); Value: 100pF; Published: 8-Jun-2000; LatestRevisionDate: 17-Jul-2002; LatestRevisionNote: Re-released for DXP Platform.; PackageReference: RB7.6-15; Publisher: Altium Limited
F1 F4 = Fuse 1: Fuse; Published: 8-Jun-2000; LatestRevisionDate: 17-Jul-2002; LatestRevisionNote: Re-released for DXP Platform.; PackageReference: PIN-W2/E2.8; Publisher: Altium Limited; PackageDescription: Thru-Hole; 2 Leads
L3 = INDUCTOR
LED17 = LED
P10 = Header 3: Header, 3-Pin; LatestRevisionDate: 17-Jul-2002; LatestRevisionNote: Re-released for DXP Platform.; Publisher: Altium Limited
Q2 = SQ3419AEEV-T1_GE3: Automotive P-Channel MOSFET, 6.9 A, 40 V, -55 to 175 degC, 6-Pin TSOP, RoHS, Tape and Reel; Manufacturer: International Rectifier; Rated Power Dissipation: 2W; Qg Gate Charge: 25nC; Drain-to-Source Voltage [Vdss]: 40V; Drain-Source On Resistance-Max: 112mO; Channel Type: P-Channel; Package Description: 6-Pin Thin Small Outline Package, Body 3 x 1.65 mm, Pitch 1.00 mm; Datasheet URL: https://www.vishay.com/docs/65332/sq3419aeev.pdf; Mounting Technology: SurfaceMount; Package Reference: TSOP-6; Manufacturer URL: https://www.vishay.com/; Datasheet Version: 04/2010
R25 R178 = RES0603: 物料主编码(PN): 150000040; Value: 100K; ID: 233; 序号: 109; 物料名称: 贴片电阻; 精度: ±1%; 规格型号(完整型号): RC1608F103CS/RC0603FR-0710KL; 物料描述: RES,贴片电阻,0603,10k,±1%,1/10W,1.6X0.8X0.45mm,RC1608F103CS/RC0603FR-0710KL; 工作温度: –55°C to 155°C; 制造商: 三星/YAGEO; 器件等级: ——; 物料类型: 表贴电阻; 参数值: 1.00E+04
R102 = R
R179 = Res1: Resistor; Published: 8-Jun-2000; LatestRevisionDate: 17-Jul-2002; LatestRevisionNote: Re-released for DXP Platform.; PackageReference: AXIAL-0.3; Publisher: Altium Limited
U6 = LM22676MR-5.0

## Sheet relay1.SchDoc
size A3
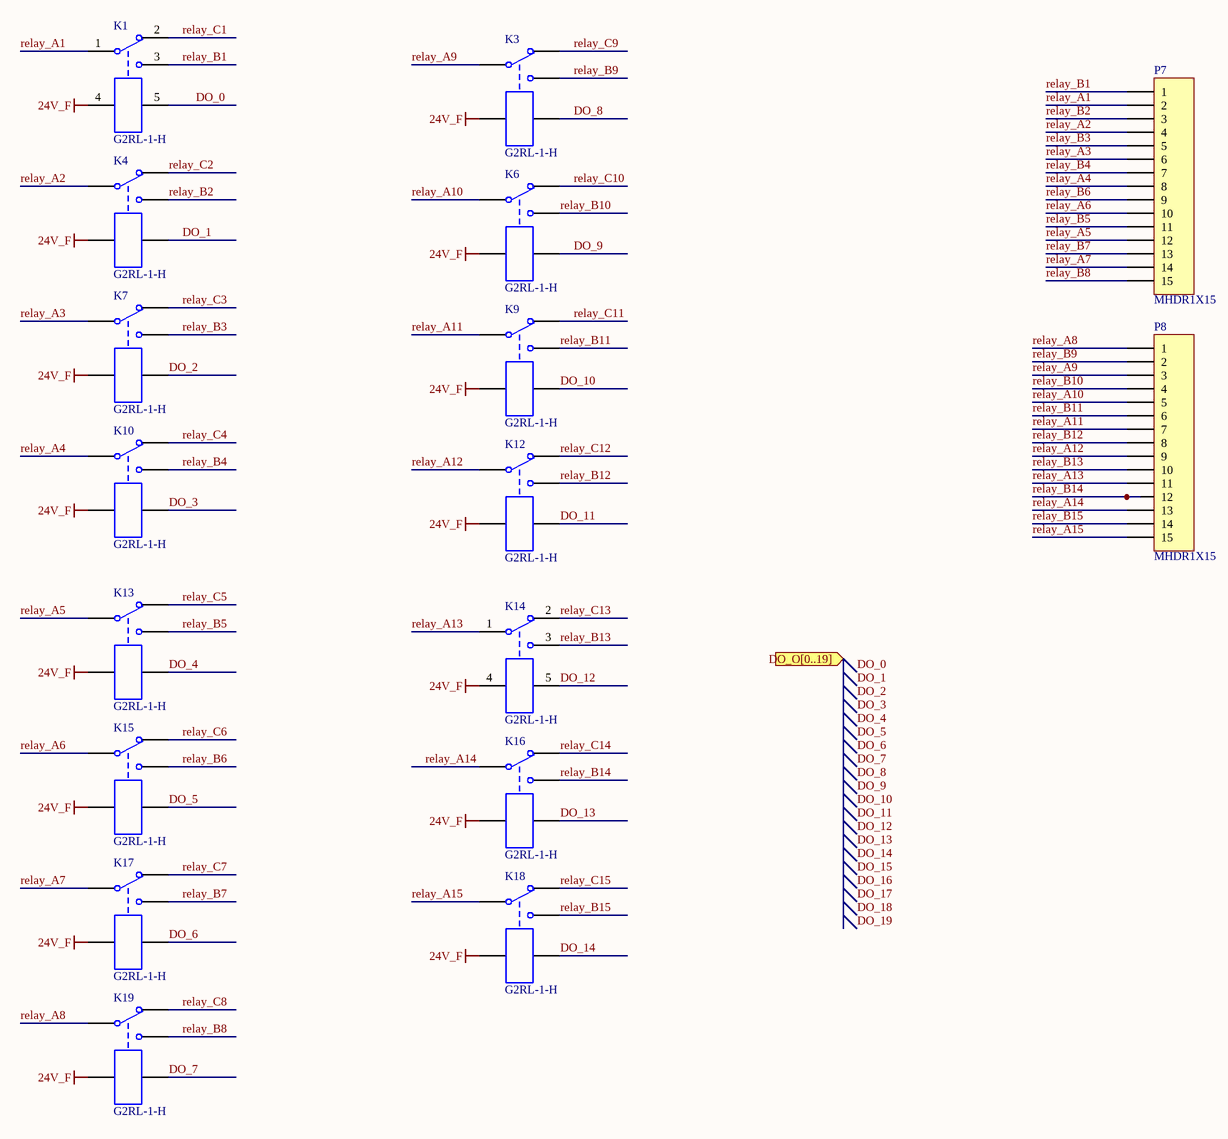
[diagram p7: relay1.SchDoc]

### Parts
K1  G2RL-1-H  [G2RL-1-H]
K3  G2RL-1-H  [G2RL-1-H]
K4  G2RL-1-H  [G2RL-1-H]
K6  G2RL-1-H  [G2RL-1-H]
K7  G2RL-1-H  [G2RL-1-H]
K9  G2RL-1-H  [G2RL-1-H]
K10  G2RL-1-H  [G2RL-1-H]
K12  G2RL-1-H  [G2RL-1-H]
K13  G2RL-1-H  [G2RL-1-H]
K14  G2RL-1-H  [G2RL-1-H]
K15  G2RL-1-H  [G2RL-1-H]
K16  G2RL-1-H  [G2RL-1-H]
K17  G2RL-1-H  [G2RL-1-H]
K18  G2RL-1-H  [G2RL-1-H]
K19  G2RL-1-H  [G2RL-1-H]
P7  MHDR1X15  [2ETYR-5.08-15P-14-100]
P8  MHDR1X15  [2ETYR-5.08-15P-14-100]

### Ports
DO_O[0..19] (in)

### Nets
24V_F: K1.4 K3.4 K4.4 K6.4 K7.4 K9.4 K10.4 K12.4 K13.4 K14.4 K15.4 K16.4 K17.4 K18.4 K19.4
DO_0: K1.5
DO_1: K4.5
DO_2: K7.5
DO_3: K10.5
DO_4: K13.5
DO_5: K15.5
DO_6: K17.5
DO_7: K19.5
DO_8: K3.5
DO_9: K6.5
DO_10: K9.5
DO_11: K12.5
DO_12: K14.5
DO_13: K16.5
DO_14: K18.5
relay_A1: K1.1 P7.2
relay_A2: K4.1 P7.4
relay_A3: K7.1 P7.6
relay_A4: K10.1 P7.8
relay_A5: K13.1 P7.12
relay_A6: K15.1 P7.10
relay_A7: K17.1 P7.14
relay_A8: K19.1 P8.1
relay_A9: K3.1 P8.3
relay_A10: K6.1 P8.5
relay_A11: K9.1 P8.7
relay_A12: K12.1 P8.9
relay_A13: K14.1 P8.11
relay_A14: K16.1 P8.13
relay_A15: K18.1 P8.15
relay_B1: K1.3 P7.1
relay_B2: K4.3 P7.3
relay_B3: K7.3 P7.5
relay_B4: K10.3 P7.7
relay_B5: K13.3 P7.11
relay_B6: K15.3 P7.9
relay_B7: K17.3 P7.13
relay_B8: K19.3 P7.15
relay_B9: K3.3 P8.2
relay_B10: K6.3 P8.4
relay_B11: K9.3 P8.6
relay_B12: K12.3 P8.8
relay_B13: K14.3 P8.10
relay_B14: K16.3 P8.12
relay_B15: K18.3 P8.14
relay_C1: K1.2
relay_C2: K4.2
relay_C3: K7.2
relay_C4: K10.2
relay_C5: K13.2
relay_C6: K15.2
relay_C7: K17.2
relay_C8: K19.2
relay_C9: K3.2
relay_C10: K6.2
relay_C11: K9.2
relay_C12: K12.2
relay_C13: K14.2
relay_C14: K16.2
relay_C15: K18.2

### Notes on the sheet
- Labels drawn without touching a wire or pin: DO_0, DO_1, DO_2, DO_3, DO_4, DO_5, DO_6, DO_7, DO_8, DO_9, DO_10, DO_11, DO_12, DO_13, DO_14, DO_15, DO_16, DO_17, DO_18, DO_19

### Library data of the parts
K1 K3 K4 K6 K7 K9 K10 K12-K19 = Relay-SPDT: Single-Pole Dual-Throw Relay; Published: 24-Mar-1999; LatestRevisionDate: 17-Jul-2002; LatestRevisionNote: Re-released for DXP Platform.; PackageReference: MODULE5B; Publisher: Altium Limited
P7 P8 = MHDR1X15: Header, 15-Pin; LatestRevisionDate: 17-Jul-2002; LatestRevisionNote: Re-released for DXP Platform.; Publisher: Altium Limited

## Nets that join several sheets
3.3V_ISO: ai (9 pins), di (16 pins), mcu (FB5.1 FB6.1)
24V_F: ai (D52.2 P1.10), di (49 pins), power1 (5 pins), relay1 (15 pins)
FGND: ai (52 pins), di (D76.1 P3.9 P11.9), power1 (10 pins)
GND: ai (9 pins), di (16 pins), mcu (17 pins), power1 (10 pins)
VCC_5V_ISO: ai (FB1.1 FB2.1 FB4.1), power1 (5 pins)
DI_IN0: di (R82.2 U25.16), mcu (U44.37)
DI_IN1: di (R87.2 U25.14), mcu (U44.38)
DI_IN2: di (R93.2 U25.12), mcu (U44.39)
DI_IN3: di (R97.2 U25.10), mcu (U44.40)
DI_IN4: di (R109.2 U17.16), mcu (U44.33)
DI_IN5: di (R114.2 U17.14), mcu (U44.34)
DI_IN6: di (R116.2 U17.12), mcu (U44.35)
DI_IN7: di (R118.2 U17.10), mcu (U44.36)
DI_IN8: di (R10.2 U7.16), mcu (U44.8)
DI_IN9: di (R16.2 U7.14), mcu (U44.9)
DI_IN10: di (R32.2 U7.12), mcu (U44.10)
DI_IN11: di (R34.2 U7.10), mcu (U44.11)
DI_IN12: di (R36.2 U8.16), mcu (U44.4)
DI_IN13: di (R41.2 U8.14), mcu (U44.3)
DI_IN14: di (R43.2 U8.12), mcu (U44.2)
DI_IN15: di (R47.2 U8.10), mcu (U44.58)
M~{DRDY}_MCU: ai (U9.12), mcu (U44.27)
M~{DRDY}_PT1_MCU: ai (U9.13), mcu (U44.28)
M~{DRDY}_PT2_MCU: ai (U9.14), mcu (U44.29)
MIBSPI1CLK: ai (U18.4), mcu (U44.51)
MIBSPI1MCS1: ai (U18.3), mcu (U44.30)
MIBSPI1MCS2: ai (U10.3), mcu (U44.45)
MIBSPI1MCS3: ai (U10.4), mcu (U44.44)
MIBSPI1SIMO: ai (U18.5), mcu (U44.57)
MIBSPI1SOMI: ai (U18.6), mcu (U44.52)
MSTART_MCU: ai (U9.11), mcu (U44.26)